# Altium schematic sheet Microcontroller+Zero.SchDoc
size A4
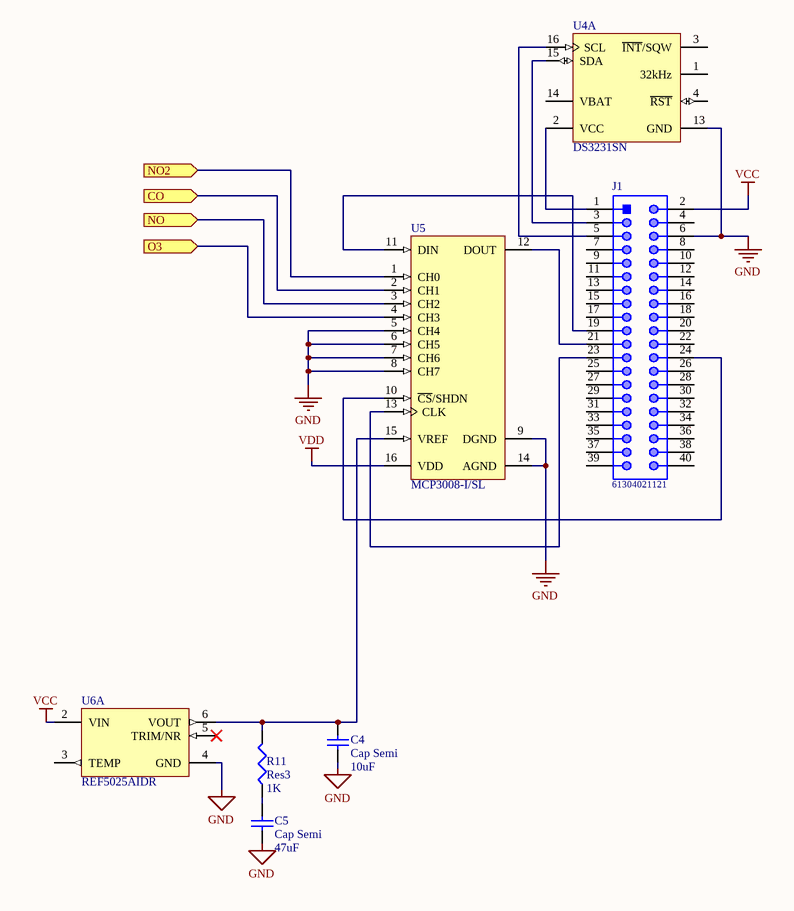
[diagram p0: Microcontroller+Zero.SchDoc]

## Parts
C4  Cap Semi  value 10uF  [C1206]
C5  Cap Semi  value 47uF  [C1206]
J1  61304021121  [61304021121]
R11  Res3  value 1K  [J1-0603]
U4  DS3231SN  [W16-H2_L]  (part A of 2)
U5  MCP3008-I/SL  [SOIC-SL16_L]
U6  REF5025AIDR  [D0008A_L]  (part A of 2)

## Ports
CO (in), NO2 (in), NO (in), O3 (in)

## Nets
GND: C4.1 C5.1 J1.6 U4.13(GND) U5.5(CH4) U5.6(CH5) U5.7(CH6) U5.8(CH7) U5.9(DGND) U5.14(AGND) U6.4(GND)
VCC: J1.2 U6.2(VIN)
VDD: U5.16(VDD)
CO: U5.2(CH1) ; port CO
NO: U5.3(CH2) ; port NO
NO2: U5.1(CH0) ; port NO2
O3: U5.4(CH3) ; port O3
NetC4_2: C4.2 R11.2 U5.15(VREF) U6.6(VOUT)
NetC5_2: C5.2 R11.1
NetJ1_1: J1.1 U4.2(VCC)
NetJ1_3: J1.3 U4.15(SDA)
NetJ1_5: J1.5 U4.16(SCL)
NetJ1_19: J1.19 U5.11(DIN)
NetJ1_21: J1.21 U5.12(DOUT)
NetJ1_23: J1.23 U5.13(CLK)
NetJ1_24: J1.24 U5.10(~{CS}/SHDN)

Not connected (* = marked no-connect by the designer): J1 4 7 8 9 10 11 12 13 14 15 16 17 18 20 22 25 26 27 28 29 30 31 32 33 34 35 36 37 38 39 40; U4 1(32kHz) 3(~{INT}/SQW) 4(~{RST}) 14(VBAT); U6 3(TEMP) 5(TRIM/NR)*

## Library data of the parts
C4 C5 = Cap Semi: Capacitor (Semiconductor SIM Model); Published: 8-Jun-2000; LatestRevisionDate: 29-May-2009; LatestRevisionNote: IPC-7351 Footprint Added.; PackageReference: C1206; Publisher: Altium Limited; PackageDescription: Chip Capacitor
J1 = CMP-1502-01135-1: THT Vertical Pin Header WR-PHD, Pitch 2.54 mm, Dual Row, 40 pins; Manufacturer: Wurth Elektronik; Contact Resistance: 20mOhm; Pitch: 2.54mm; Pin Number: 40; Withstanding Voltage: 500VAC; Gender: Male; Rated Current: 3A; Working Voltage: 250VAC; Operating Temperature: -40to105degC; Manufacturer URL: http://www.we-online.de; Orientation: Vertical; Datasheet URL: https://katalog.we-online.de/em/datasheet/6130xx21121.pdf; Package Reference: 61304021121; Row Number: Dual; Part Number: 61304021121; Packaging: Bag; Mounting Technology: THT; Publisher: WurthElektronik
R11 = Res3: Resistor; Published: 8-Jun-2000; LatestRevisionDate: 29-May-2009; LatestRevisionNote: IPC-7351 Footprint Added.; PackageReference: J1-0603; Publisher: Altium Limited; PackageDescription: Chip Resistor
U4 = CMP-0254-00293-1: Extremely Accurate I2C-Integrated Real-Time Clock/TCXO/Crystal, 16-Pin SO, -40 to 85 degC; ComponentLink1Description: Manufacturer URL; ComponentLink3URL: http://pdfserv.maxim-ic.com/package_dwgs/21-0042.PDF; ComponentLink3Description: Package Specification; PackageVersion: revD, 2010; ComponentLink2URL: http://datasheets.maxim-ic.com/en/ds/DS3231.pdf; ComponentLink2Description: Datasheet; PackageReference: W16-H2; Code_JEDEC: MS-013-AA; ComponentLink1URL: http://www.maxim-ic.com; PackageDescription: 16-Pin Small-Outline IC, Wide (0.3in), 1.27 mm Pitch, SOIC (W); Code_IPC: SOIC127P1030-16; DatasheetVersion: Rev 8, Jul-2010
U5 = CMP-0188-00041-2: 2.7V 4-Channel/8-Channel 10-Bit A/D Converters with SPI Serial Interface, 16-Pin SOIC 150mil, Industrial Temperature; ComponentLink1URL: http://www.microchip.com/; ComponentLink3Description: Package Specification; PackageDescription: 16-Lead Plastic Small Outline (SL) - Narrow, 3.90mm Body [SOIC]; PackageVersion: revBB, Aug-2009; ComponentLink2Description: Datasheet; Code_IPC: SOIC127P600-16; RevisionNote: URLs added.; ComponentLink3URL: http://www.microchip.com/stellent/groups/techpub_sg/documents/packagingspec/en012702.pdf; ComponentLink1Description: Manufacturer URL; ComponentLink2URL: http://ww1.microchip.com/downloads/en/DeviceDoc/21295d.pdf; Code_JEDEC: MS-012-AC; DatasheetVersion: revD, Dec-2008; PackageReference: SOIC-SL16
U6 = CMP-0367-00041-2: Low Noise, Very Low Drift, Precision Voltage Reference, -40 to 125 degC, 8-pin SOIC (D), Green (RoHS & no Sb/Br); Manufacturer: Texas Instruments; VO(V): 2.5; Iout/Iz(Max)(mA): 10; Initial Accuracy @ 25/deg C(%): 0.05; VI(Max)(V): 18; Iq(Max)(uA): 1000; Rating: Military; Temp Coeff(Max)(ppm/ degree C): 3; SubFamily: Series Voltage Reference; VI(Min)(V): 2.7; DatasheetVersion: SBOS410E; Eco-Plan: Green (RoHS & no Sb/Br); ComponentLink2URL: http://www.ti.com/general/docs/lit/getliterature.tsp?genericPartNumber=REF5025&fileType=pdf; PackageVersion: 4040047-3/M; PackageDescription: 8-Pin Plastic Small Outline, Body 4.9 x 3.9 mm, Pitch 1.27 mm; PartNumber: REF5025AIDR; ComponentLink3Description: Package Specification; ComponentLink1URL: http://www.ti.com/; ComponentLink1Description: Manufacturer URL; PackageReference: D0008A; ComponentLink3URL: http://www.ti.com/litv/pdf/msoi002j; Mounting Technology: Surface Mount; ComponentLink2Description: Datasheet; Code_JEDEC: MS-012